# EAGLE design main (EAGLE 7.7.0)
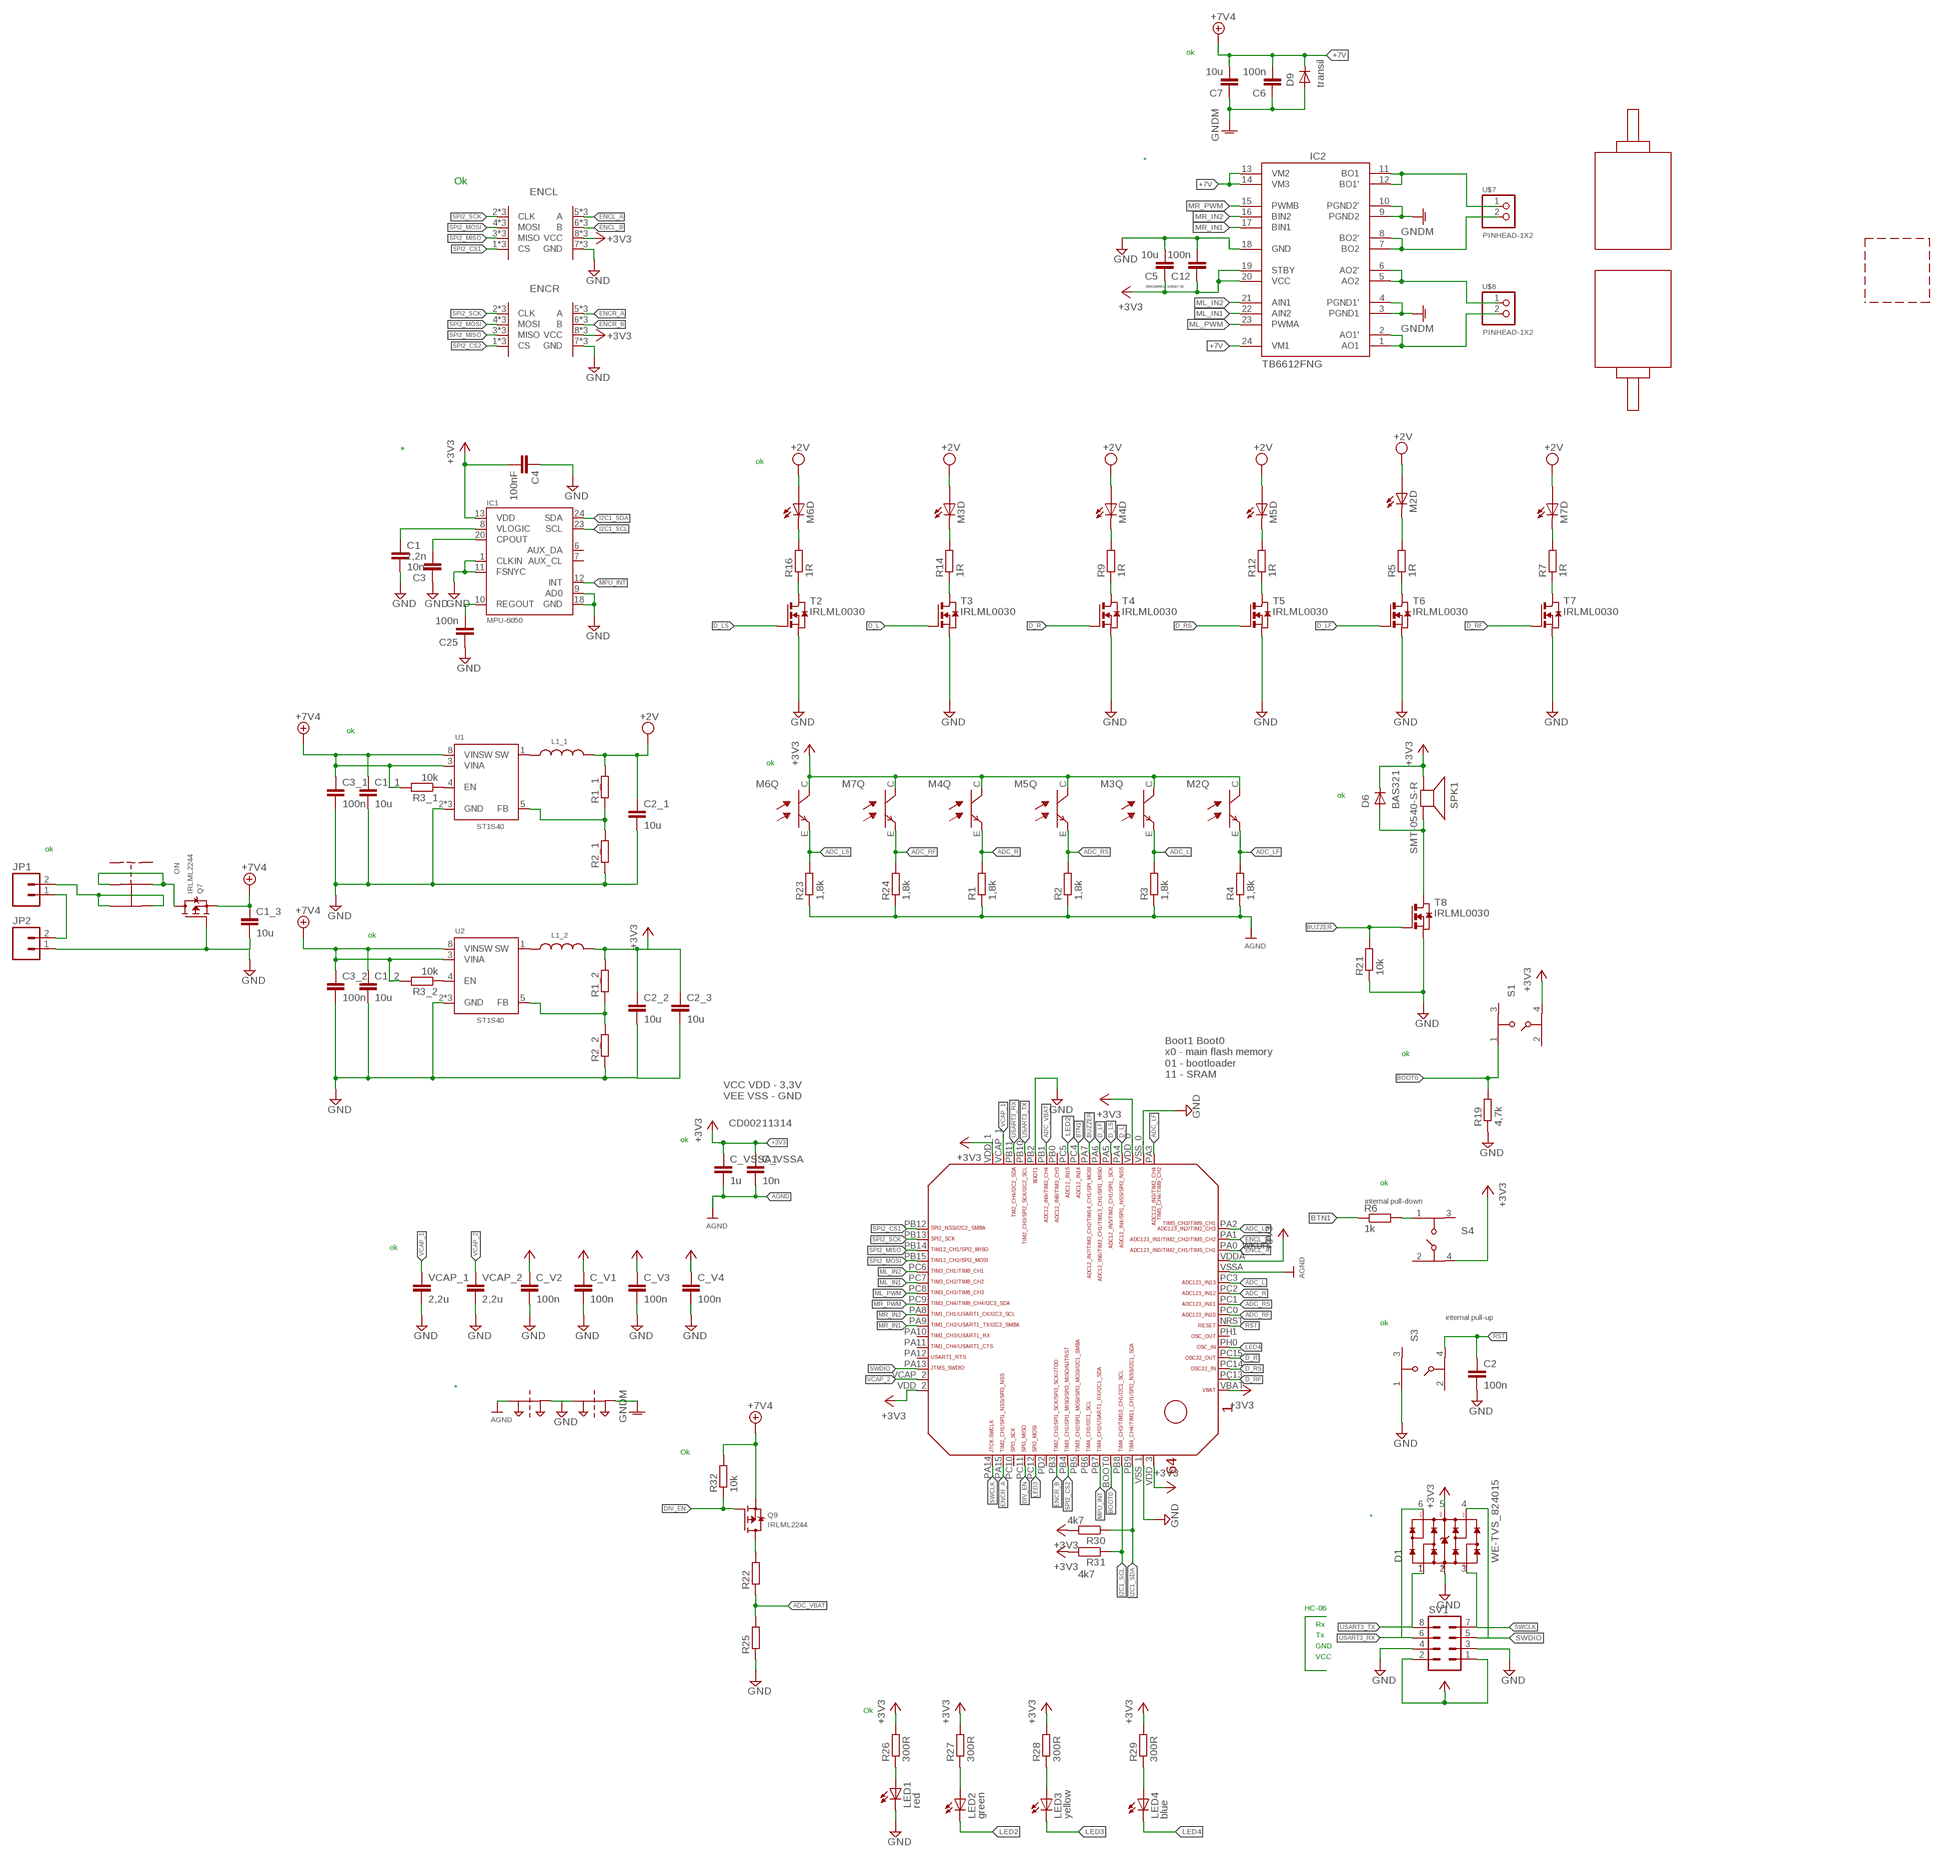
[diagram p0: schematic, sheet 1]

## Parts
C1  10n  C-EUC0603  [C0603]
C1_1  10u  C-EUC0805  [C0805]
C1_2  10u  C-EUC0805  [C0805]
C1_3  10u  C-EUC0805  [C0805]
C2  100n  C-EUC0603  [C0603]
C2_1  10u  C-EUC0805  [C0805]
C2_2  10u  C-EUC0805  [C0805]
C2_3  10u  C-EUC0805  [C0805]
C3  2,2n  C-EUC0603  [C0603]
C3_1  100n  C-EUC0603  [C0603]
C3_2  100n  C-EUC0603  [C0603]
C4  100nF  C-EUC0603  [C0603]
C5  10u  C-EUC0805  [C0805]
C6  100n  C-EUC0603  [C0603]
C7  10u  C-EUC1206  [C1206]
C12  100n  C-EUC0603  [C0603]
C25  100n  C-EUC0603  [C0603]
C_V1  100n  C-EUC0603  [C0603]
C_V2  100n  C-EUC0603  [C0603]
C_V3  100n  C-EUC0603  [C0603]
C_V4  100n  C-EUC0603  [C0603]
C_VSSA  10n  C-EUC0603  [C0603]
C_VSSA1  1u  C-EUC0603  [C0603]
D1  WE-TVS_824015  [WE-TVS_SOT23-6L]
D6  BAS321  [SOD323(F)]
D9  transil  BAS321  [SOD323(F)]
IC1  MPU-6050  [QFN.24.4X4]
IC2  TB6612FNG  [SSOP24]
JP1  M02POLAR  [MOLEX-1X2]
JP2  M02POLAR  [MOLEX-1X2]
L1  LABITYNT  [LABIRYNT]
L1_1  WE-MAIA_3015_78438335068  [WE-MAIA_3015]
L1_2  WE-MAIA_3015_78438335033  [WE-MAIA_3015]
LED1  red  LEDSML1206  [SML1206]
LED2  green  LEDSML1206  [SML1206]
LED3  yellow  LEDSML1206  [SML1206]
LED4  blue  LEDSML1206  [SML1206]
M1  MOTOR_MOUNT_V2  [MOTOR_MOUNT_V2]
M2  LED_MOUNT  [LED_MOUNT]
M3  LED_MOUNT  [LED_MOUNT]
M4  LED_MOUNT  [LED_MOUNT]
M5  LED_MOUNT  [LED_MOUNT]
M6  LED_MOUNT  [LED_MOUNT]
M7  LED_MOUNT  [LED_MOUNT]
ON  PRZELACZNIK_SUWAKOWY  [PRZELACZNIK_SUWAKOWY]
PT1  2PT_GND_TIE  [2PT_GND_TIE]
PT2  2PT_GND_TIE  [2PT_GND_TIE]
Q7  IRLML2244  MOSFET-P  [SOT23-R]
Q9  IRLML2244  MOSFET-P  [SOT23-R]
R1  1,8k  R-EU_R0603  [R0603]
R1_1  R-EU_R0603  [R0603]
R1_2  R-EU_R0603  [R0603]
R2  1,8k  R-EU_R0603  [R0603]
R2_1  R-EU_R0603  [R0603]
R2_2  R-EU_R0603  [R0603]
R3  1,8k  R-EU_R0603  [R0603]
R3_1  10k  R-EU_R0603  [R0603]
R3_2  10k  R-EU_R0603  [R0603]
R4  1,8k  R-EU_R0603  [R0603]
R5  1R  R-EU_R0603  [R0603]
R6  1k  R-EU_R0603  [R0603]
R7  1R  R-EU_R0603  [R0603]
R9  1R  R-EU_R0603  [R0603]
R12  1R  R-EU_R0603  [R0603]
R14  1R  R-EU_R0603  [R0603]
R16  1R  R-EU_R0603  [R0603]
R19  4,7k  R-EU_R0603  [R0603]
R21  10k  R-EU_R0603  [R0603]
R22  R-EU_R0603  [R0603]
R23  1,8k  R-EU_R0603  [R0603]
R24  1,8k  R-EU_R0603  [R0603]
R25  R-EU_R0603  [R0603]
R26  300R  R-EU_R0603  [R0603]
R27  300R  R-EU_R0603  [R0603]
R28  300R  R-EU_R0603  [R0603]
R29  300R  R-EU_R0603  [R0603]
R30  4k7  R-EU_R0603  [R0603]
R31  4k7  R-EU_R0603  [R0603]
R32  10k  R-EU_R0603  [R0603]
S1  434153017835  [434153017835]
S3  434153017835  [434153017835]
S4  434153017835  [434153017835]
SPK1  SMT-0540-S-R  [SMT-0540-S-R]
SV1  MA04-2  [MA04-2]
T2  IRLML0030  NMOSSOT23  [SOT-23]
T3  IRLML0030  NMOSSOT23  [SOT-23]
T4  IRLML0030  NMOSSOT23  [SOT-23]
T5  IRLML0030  NMOSSOT23  [SOT-23]
T6  IRLML0030  NMOSSOT23  [SOT-23]
T7  IRLML0030  NMOSSOT23  [SOT-23]
T8  IRLML0030  NMOSSOT23  [SOT-23]
U1  ST1S40  [SO8]
U2  ST1S40  [SO8]
U3  STM32F4X5  [STM32F4-LQFP64]
U$7  PINHEAD-1X2  [PIHEAD-1X2]
U$8  PINHEAD-1X2  [PIHEAD-1X2]
U$9  ENCODER_MOUNT  [ENCODER_MOUNT]
U$10  ENCODER_MOUNT  [ENCODER_MOUNT]
VCAP_1  2,2u  C-EUC0603  [C0603]
VCAP_2  2,2u  C-EUC0603  [C0603]

## Nets
+3V3: C2_2.1 C2_3.1 C4.2 C5.1 C12.1 C_V1.1 C_V2.1 C_V3.1 C_V4.1 C_VSSA1.1 C_VSSA.1 D1.5(VDD) D6.1(K) IC1.13(VDD) IC2.19(STBY) IC2.20(VCC) L1_2.2 M2.C(Q:C) M3.C(Q:C) M4.C(Q:C) M5.C(Q:C) M6.C(Q:C) M7.C(Q:C) R1_2.2 R26.2 R27.2 R28.2 R29.2 R30.2 R31.2 S1.4 S4.4 SPK1.-(+) SV1.1 SV1.2 U3.VBAT U3.VDD_0 U3.VDD_1 U3.VDD_2 U3.VDD_3 U3.VDDA U$9.8(VCC) U$9.8_1(VCC) U$9.8_2(VCC) U$10.8(VCC) U$10.8_1(VCC) U$10.8_2(VCC)
+7V: C1_1.1 C1_2.1 C1_3.1 C3_1.1 C3_2.1 C6.2 C7.2 D9.1(K) IC2.13(VM2) IC2.14(VM3) IC2.24(VM1) Q7.2(S) Q9.2(S) R3_1.2 R3_2.2 R32.2 U1.3(VINA) U1.8(VINSW) U2.3(VINA) U2.8(VINSW) ; supply symbol labelled +7V4
ADC_L: M3.E(Q:E) R3.2 U3.PC3
ADC_LF: M2.E(Q:E) R4.2 U3.PA3
ADC_LS: M6.E(Q:E) R23.2 U3.PA2
ADC_R: M4.E(Q:E) R1.2 U3.PC2
ADC_RF: M7.E(Q:E) R24.2 U3.PC0
ADC_RS: M5.E(Q:E) R2.2 U3.PC1
ADC_VBAT: R22.1 R25.2 U3.PB1
AGND: C_VSSA1.2 C_VSSA.2 PT1.P$1 R1.1 R2.1 R3.1 R4.1 R23.1 R24.1 U3.VSSA
BOOT0: R19.2 S1.1 U3.BOOT0
BTN1: R6.1 U3.PC4
BUZZER: R21.2 T8.3(G) U3.PA7
D_L: T3.3(G) U3.PA4
D_LF: T6.3(G) U3.PA6
D_LS: T2.3(G) U3.PA5
D_R: T4.3(G) U3.PC15
D_RF: T7.3(G) U3.PC13
D_RS: T5.3(G) U3.PC14
DIV_EN: Q9.1(G) R32.1 U3.PC11
ENCL_A: U3.PA0_WKUP(PA0_AKUP) U$9.5(A) U$9.5_1(A) U$9.5_2(A)
ENCL_B: U3.PA1 U$9.6(B) U$9.6_1(B) U$9.6_2(B)
ENCR_A: U3.PA15 U$10.5(A) U$10.5_1(A) U$10.5_2(A)
ENCR_B: U3.PB3 U$10.6(B) U$10.6_1(B) U$10.6_2(B)
GND: C1.2 C1_1.2 C1_2.2 C1_3.2 C2.2 C2_1.2 C2_2.2 C2_3.2 C3.1 C3_1.2 C3_2.2 C4.1 C5.2 C12.2 C25.1 C_V1.2 C_V2.2 C_V3.2 C_V4.2 D1.2(GND) IC1.1(CLKIN) IC1.9(AD0) IC1.11(FSNYC) IC1.18(GND) IC2.18(GND) JP2.1 LED1.C PT1.P$2 PT2.P$1 Q7.1(G) R2_1.1 R2_2.1 R19.1 R21.1 R25.1 S3.1 SV1.3 SV1.4 T2.2(S) T3.2(S) T4.2(S) T5.2(S) T6.2(S) T7.2(S) T8.2(S) U1.2(GND) U1.6(GND) U1.7(GND) U2.2(GND) U2.6(GND) U2.7(GND) U3.PB2 U3.VSS_0 U3.VSS_1 U$9.7(GND) U$9.7_1(GND) U$9.7_2(GND) U$10.7(GND) U$10.7_1(GND) U$10.7_2(GND) VCAP_1.2 VCAP_2.2
GNDA: C6.1 C7.1 D9.2(A) IC2.3(PGND1) IC2.4(PGND1') IC2.9(PGND2) IC2.10(PGND2') PT2.P$2 ; supply symbol labelled GNDM
I2C1_SCL: IC1.23(SCL) R31.1 U3.PB8
I2C1_SDA: IC1.24(SDA) R30.1 U3.PB9
LED2: LED2.C U3.PC5
LED3: LED3.C U3.PC12
LED4: LED4.C U3.PH0
ML_IN1: IC2.22(AIN2) U3.PC7
ML_IN2: IC2.21(AIN1) U3.PC6
ML_PWM: IC2.23(PWMA) U3.PC8
MPU_INT: IC1.12(INT) U3.PB7
MR_IN1: IC2.17(BIN1) U3.PA9
MR_IN2: IC2.16(BIN2) U3.PA8
MR_PWM: IC2.15(PWMB) U3.PC9
N$1: M7.-(D:C) R7.2
N$2: M2.-(D:C) R5.2
N$4: R5.1 T6.1(D)
N$5: R7.1 T7.1(D)
N$6: M4.-(D:C) R9.2
N$7: R9.1 T4.1(D)
N$8: M5.-(D:C) R12.2
N$9: R12.1 T5.1(D)
N$10: M3.-(D:C) R14.2
N$11: R14.1 T3.1(D)
N$12: M6.-(D:C) R16.2
N$13: R16.1 T2.1(D)
N$14: Q9.3(D) R22.2
N$15: L1_1.1 U1.1(SW)
N$16: L1_2.1 U2.1(SW)
N$17: R3_1.1 U1.4(EN)
N$18: R3_2.1 U2.4(EN)
N$19: JP1.1 JP2.2
N$20: LED1.A R26.1
N$21: LED2.A R27.1
N$22: LED3.A R28.1
N$24: LED4.A R29.1
N$25: R6.2 S4.1
N$29: C25.2 IC1.10(REGOUT)
N$30: D6.2(A) SPK1.+(-) T8.1(D)
N$33: C3.2 IC1.20(CPOUT)
N$34: C1.1 IC1.8(VLOGIC)
N$37: IC2.1(AO1) IC2.2(AO1') U$8.2
N$38: IC2.11(BO1) IC2.12(BO1') U$7.1
N$39: IC2.7(BO2) IC2.8(BO2') U$7.2
N$40: IC2.5(AO2) IC2.6(AO2') U$8.1
N$43: ON.2 ON.5 Q7.3(D)
N$46: JP1.2 ON.3 ON.6
N$52: R1_2.1 R2_2.2 U2.5(FB)
N$53: R1_1.1 R2_1.2 U1.5(FB)
RST: C2.1 S3.4 U3.NRST
SPI2_CS1: U3.PB12 U$9.1(CS) U$9.1_1(CS) U$9.1_2(CS)
SPI2_CS2: U3.PB4 U$10.1(CS) U$10.1_1(CS) U$10.1_2(CS)
SPI2_MISO: U3.PB14 U$9.3(MISO) U$9.3_1(MISO) U$9.3_2(MISO) U$10.3(MISO) U$10.3_1(MISO) U$10.3_2(MISO)
SPI2_MOSI: U3.PB15 U$9.4(MOSI) U$9.4_1(MOSI) U$9.4_2(MOSI) U$10.4(MOSI) U$10.4_1(MOSI) U$10.4_2(MOSI)
SPI2_SCK: U3.PB13 U$9.2(CLK) U$9.2_1(CLK) U$9.2_2(CLK) U$10.2(CLK) U$10.2_1(CLK) U$10.2_2(CLK)
SWCLK: D1.3 SV1.7 U3.PA14
SWDIO: D1.4 SV1.5 U3.PA13
USART3_RX: D1.6 SV1.6 U3.PB11
USART3_TX: D1.1 SV1.8 U3.PB10
VCAP_1: U3.VCAP_1 VCAP_1.1
VCAP_2: U3.VCAP_2 VCAP_2.1
VCC: C2_1.1 L1_1.2 M2.+(D:A) M3.+(D:A) M4.+(D:A) M5.+(D:A) M6.+(D:A) M7.+(D:A) R1_1.2 ; supply symbol labelled +2V
Unconnected: IC1.6(AUX_DA) IC1.7(AUX_CL) ON.1 ON.4 S1.2 S1.3 S3.2 S3.3 S4.2 S4.3 U3.PA10 U3.PA11 U3.PA12 U3.PB0 U3.PB5 U3.PB6 U3.PC10 U3.PD2 U3.PH1

## Notes on the sheet
- ok
- *
- Ok
- ENCL
- GRM188R61C106MA73D
- ENCR
- *
- ok
- ok
- ok
- ok
- ok
- ok
- ok
- Boot1 Boot0
  x0 - main flash memory
  01 - bootloader
  11 - SRAM
- VCC VDD - 3,3V
  VEE VSS - GND
- CD00211314
- ok
- ok
- internal pull-down
- ok
- internal pull-up
- ok
- *
- Ok
- *
- HC-06
- Rx
- Tx
- GND
- VCC
- Ok

## Library data of the parts
C1 C1_1-C1_3 C2 C2_1-C2_3 C3 C3_1 C3_2 C4-C7 C12 C25 C_V1-C_V4 C_VSSA C_VSSA1 VCAP_1 VCAP_2 = rcl:C-EU: CAPACITOR, European symbol
D1 = EAGLE-POWER_MAGNETICS-rev17a:WE-TVS_824015: TVS Diode High Speed Series Characteristics Low clamping voltage Sturdy design Very low capacitance Flow Thru Design for a simple layout Rail to Rail protection Epoxy flame resistant UL94 V-0 RoHS, REACH and free of halogens Applications Very fast data lines USB 2.0 Ethernet PoE VGA Sim Cards Keypads ESD protection in accordance with EN 61000-4-2, – 8 kV contact discharge – 15 kV air discharge <http://katalog.we-online.de/media/images/v2/Family_WE-TVS_HIGHSPEED.jpg> Details see: http://katalog.we-online.de/en/pbs/WE-TVS_High_Speed/824001? Updated by Dan Xu 2014-07-11 2014 (C) Wurth Elektronik
D6 D9 = nxp_60:BAS321: General purpose diode The BAS321 is a general purpose diode fabricated in planar technology and encapsulated in a plastic SOD323 package. AAL Eindhoven MK
IC1 = invensense:MPU-6050
IC2 = _microMouse:TB6612FNG: TB6612FNG MOS dual H-bridge motor driver, 1.2A current 3.2A peak 3 or 5v logic and 3-15v motor
JP1 JP2 = SparkFun_conn:M02: Standard 2-pin 0.1" header. Use with - straight break away headers ( PRT-00116) - right angle break away headers (PRT-00553) - swiss pins (PRT-00743) - machine pins (PRT-00117) - female headers (PRT-00115) Molex polarized connector foot print use with: PRT-08233 with associated crimp pins and housings. 2.54_SCREWTERM for use with PRT-10571. 3.5mm Screw Terminal footprints for PRT-08084 5mm Screw Terminal footprints for use with PRT-08432
L1 = micromouse:LABITYNT
L1_1 = EAGLE-AECQ_PRODUCTS-rev17b:WE-MAIA_3015: WE-MAIA SMD Power Inductor Characteristics Magnetic iron alloy allows high rated currents Compact design Magnetically shielded Hight current capability and handles hight transient current spikes No acoustic noise and no leakage flux noise Operating temperature range:-40°C up to 125°C Applications Power supplies for smartphones, tablet PCs and other mobile devices DC/DC-converter for high current power supplies DC/DC-converter for Field Programmable Gate Array (FPGA) POL-converters Portable power like PDA, digital camera Mainboards/graphic cards Battery powered devices Wireless communication devices <http://katalog.we-online.de/media/images/eisos/IndMAIA_pf2.jpg> Details see: http://katalog.we-online.de/en/pbs/WE-MAIA/ Created: 2015-02-04 2015 (C) Wurth Elektronik; WE-NUMBER: 78438335068/6,8uH
L1_2 = EAGLE-AECQ_PRODUCTS-rev17b:WE-MAIA_3015: WE-MAIA SMD Power Inductor Characteristics Magnetic iron alloy allows high rated currents Compact design Magnetically shielded Hight current capability and handles hight transient current spikes No acoustic noise and no leakage flux noise Operating temperature range:-40°C up to 125°C Applications Power supplies for smartphones, tablet PCs and other mobile devices DC/DC-converter for high current power supplies DC/DC-converter for Field Programmable Gate Array (FPGA) POL-converters Portable power like PDA, digital camera Mainboards/graphic cards Battery powered devices Wireless communication devices <http://katalog.we-online.de/media/images/eisos/IndMAIA_pf2.jpg> Details see: http://katalog.we-online.de/en/pbs/WE-MAIA/ Created: 2015-02-04 2015 (C) Wurth Elektronik; WE-NUMBER: 78438335033/3,3uH
LED1-LED4 = led:LED: LED OSRAM: - CHIPLED LG R971, LG N971, LY N971, LG Q971, LY Q971, LO R971, LY R971 LH N974, LH R974 LS Q976, LO Q976, LY Q976 LO Q996 - Hyper CHIPLED LW Q18S LB Q993, LB Q99A, LB R99A - SideLED LS A670, LO A670, LY A670, LG A670, LP A670 LB A673, LV A673, LT A673, LW A673 LH A674 LY A675 LS A676, LA A676, LO A676, LY A676, LW A676 LS A679, LY A679, LG A679 - Hyper Micro SIDELED® LS Y876, LA Y876, LO Y876, LY Y876 LT Y87S - SmartLED LW L88C, LW L88S LB L89C, LB L89S, LG L890 LS L89K, LO L89K, LY L89K LS L896, LA L896, LO L896, LY L896 - TOPLED LS T670, LO T670, LY T670, LG T670, LP T670 LSG T670, LSP T670, LSY T670, LOP T670, LYG T670 LG T671, LOG T671, LSG T671 LB T673, LV T673, LT T673, LW T673 LH T674 LS T676, LA T676, LO T676, LY T676, LB T676, LH T676, LSB T676, LW T676 LB T67C, LV T67C, LT T67C, LS T67K, LO T67K, LY T67K, LW E67C LS E67B, LA E67B, LO E67B, LY E67B, LB E67C, LV E67C, LT E67C LW T67C LS T679, LY T679, LG T679 LS T770, LO T770, LY T770, LG T770, LP T770 LB T773, LV T773, LT T773, LW T773 LH T774 LS E675, LA E675, LY E675, LS T675 LS T776, LA T776, LO T776, LY T776, LB T776 LHGB T686 LT T68C, LB T68C - Hyper Mini TOPLED® LB M676 - Mini TOPLED Santana® LG M470 LS M47K, LO M47K, LY M47K Source: http://www.osram.convergy.de LUXEON: - LUMILED® LXK2-PW12-R00, LXK2-PW12-S00, LXK2-PW14-U00, LXK2-PW14-V00 LXK2-PM12-R00, LXK2-PM12-S00, LXK2-PM14-U00 LXK2-PE12-Q00, LXK2-PE12-R00, LXK2-PE12-S00, LXK2-PE14-T00, LXK2-PE14-U00 LXK2-PB12-K00, LXK2-PB12-L00, LXK2-PB12-M00, LXK2-PB14-N00, LXK2-PB14-P00, LXK2-PB14-Q00 LXK2-PR12-L00, LXK2-PR12-M00, LXK2-PR14-Q00, LXK2-PR14-R00 LXK2-PD12-Q00, LXK2-PD12-R00, LXK2-PD12-S00 LXK2-PH12-R00, LXK2-PH12-S00 LXK2-PL12-P00, LXK2-PL12-Q00, LXK2-PL12-R00 Source: www.luxeon.com KINGBRIGHT: KA-3528ASYC Source: www.kingbright.com
M1 = micromouse:MOTOR_MOUNT_V2
M2-M7 = micromouse:LED_MOUNT
ON = micromouse:PRZELACZNIK_SUWAKOWY
PT1 PT2 = SparkFun-Passives:2PT_GND_TIE: Package for connecting two ground nets in one place.
Q7 Q9 = microbuilder:MOSFET-P: P-Channel Mosfet LEGEND VDS: Voltage Drain-Source ID: Drain Current RDS(ON): Drain-Source On-State Resistance VGS(TH): Gate-Source Threshold Voltage CISS: Drain-Source Input Capacitance SOT-23 Name VDS ID RDS(ON) VGS(TH) CISS Order Number IRLML5103 30V 760mA 600 mOhm -- 75pF @ 25V Digikey: IRLML5103PBFCT-ND IRLML6401 12V 4.3A 50 mOhm 950mV @ 250µA 830pF @ 10V Digikey: IRLML6401PBFTR-ND NTR0202PL 20V 400mA 800 mOhm 2.3V @ 250uA 70pF @ 5V Digikey: NTR0202PLT1GOSTR-ND NTR4101PT1G 20V 1.8A 85 mOhm 1.2V @ 250uA 675pF @ 10V Digikey: NTR4101PT1GOSCT-ND DMP2004K 20V 600mA 900 mOhm 1V @ 250uA 175pF @ 16V Digikey: DMP2004KDICT-ND PMV65XP 20V 3.9A 76 mOhm 950mV @ 1mA 725pF @ 20V Digikey: 568-2358-2-ND TO-252 Name VDS ID RDS(ON) VGS(TH) CISS Order Number AOD417 30V 25A 34 mOhm 3V @ 250µA 920pF @ 15V Digikey: 785-1106-2-ND
R1 R1_1 R1_2 R2 R2_1 R2_2 R3 R3_1 R3_2 R4-R7 R9 R12 R14 R16 R19 R21 R23 R24 R30 R31 = rcl:R-EU_: RESISTOR, European symbol
R22 R25-R29 R32 = resistor:R-EU_: RESISTOR, European symbol
S1 S3 S4 = EAGLE-TACT_SWITCHES-rev17c:434153017835: WS-TASV Tact Switch J-Bend SMD version Specification Rating : 50mA, 12VDC Contact Resistance Initial: 100mΩ max. After life test:1mΩ max. Insulation Resistance: min.100MΩ at 500VDC Dielectric Strength : 250VAC for 1 minute Stroke:0.15±0.1mm Bounce :10ms max. Material Cover : : Stainless steel Stem :LCP UL 94 V-0. FramePA46 UL HB, color Black >Contact : Stainless Steel with Silver Tape:Polyimide tape Terminal : Copper Alloy with Silver <http://katalog.we-online.de/media/images/v2/WS-TASU_434331013822_a_4C.jpg> Details see: http://katalog.we-online.de/em/datasheet/434153017835.pdf 2015 (C) Würth Elektronik
SPK1 = adafruit:SMT-0540-S-R: SMT-0549-S-R Small surface-mount magnetic buzzer
SV1 = con-lstb:MA04-2: PIN HEADER; OC_FARNELL: unknown; OC_NEWARK: unknown
T2-T8 = zetex:NMOSSOT23: MOS FET; OC_FARNELL: unknown; OC_NEWARK: unknown
U1 U2 = micromouse:ST1S40
U3 = _microMouse:STM32F4X5
U$7 U$8 = BaseApp:PINHEAD-1X2
U$9 U$10 = micromouse:ENCODER_MOUNT

## Board
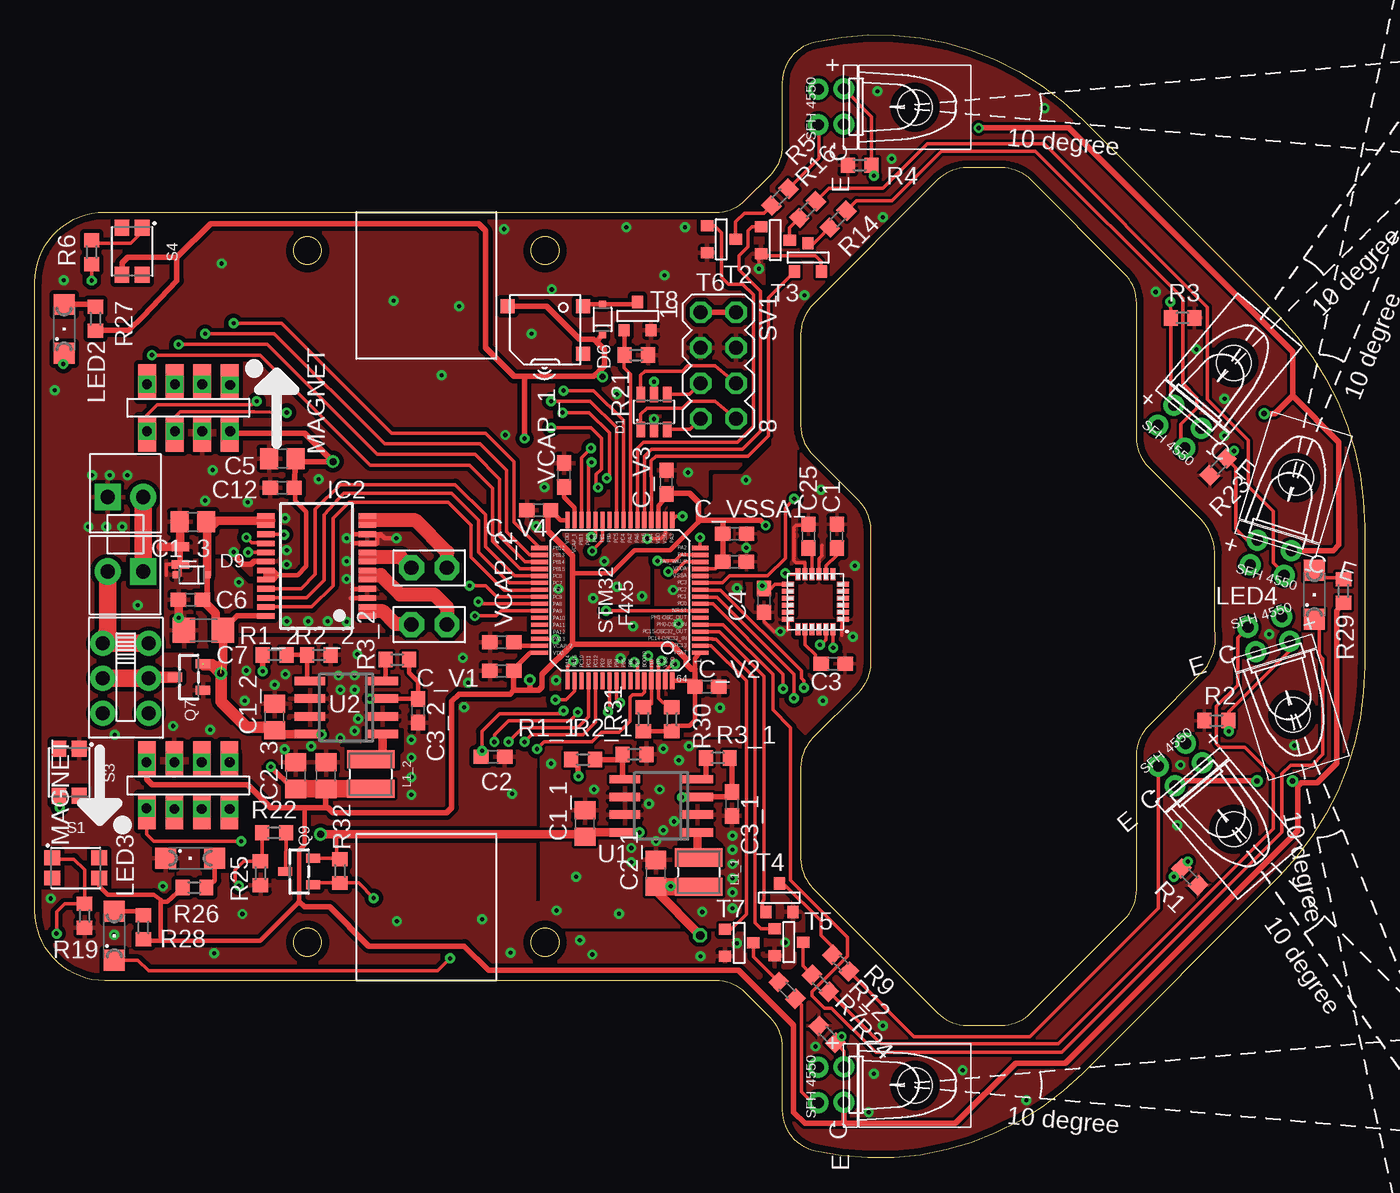
[diagram p1: board, top side]
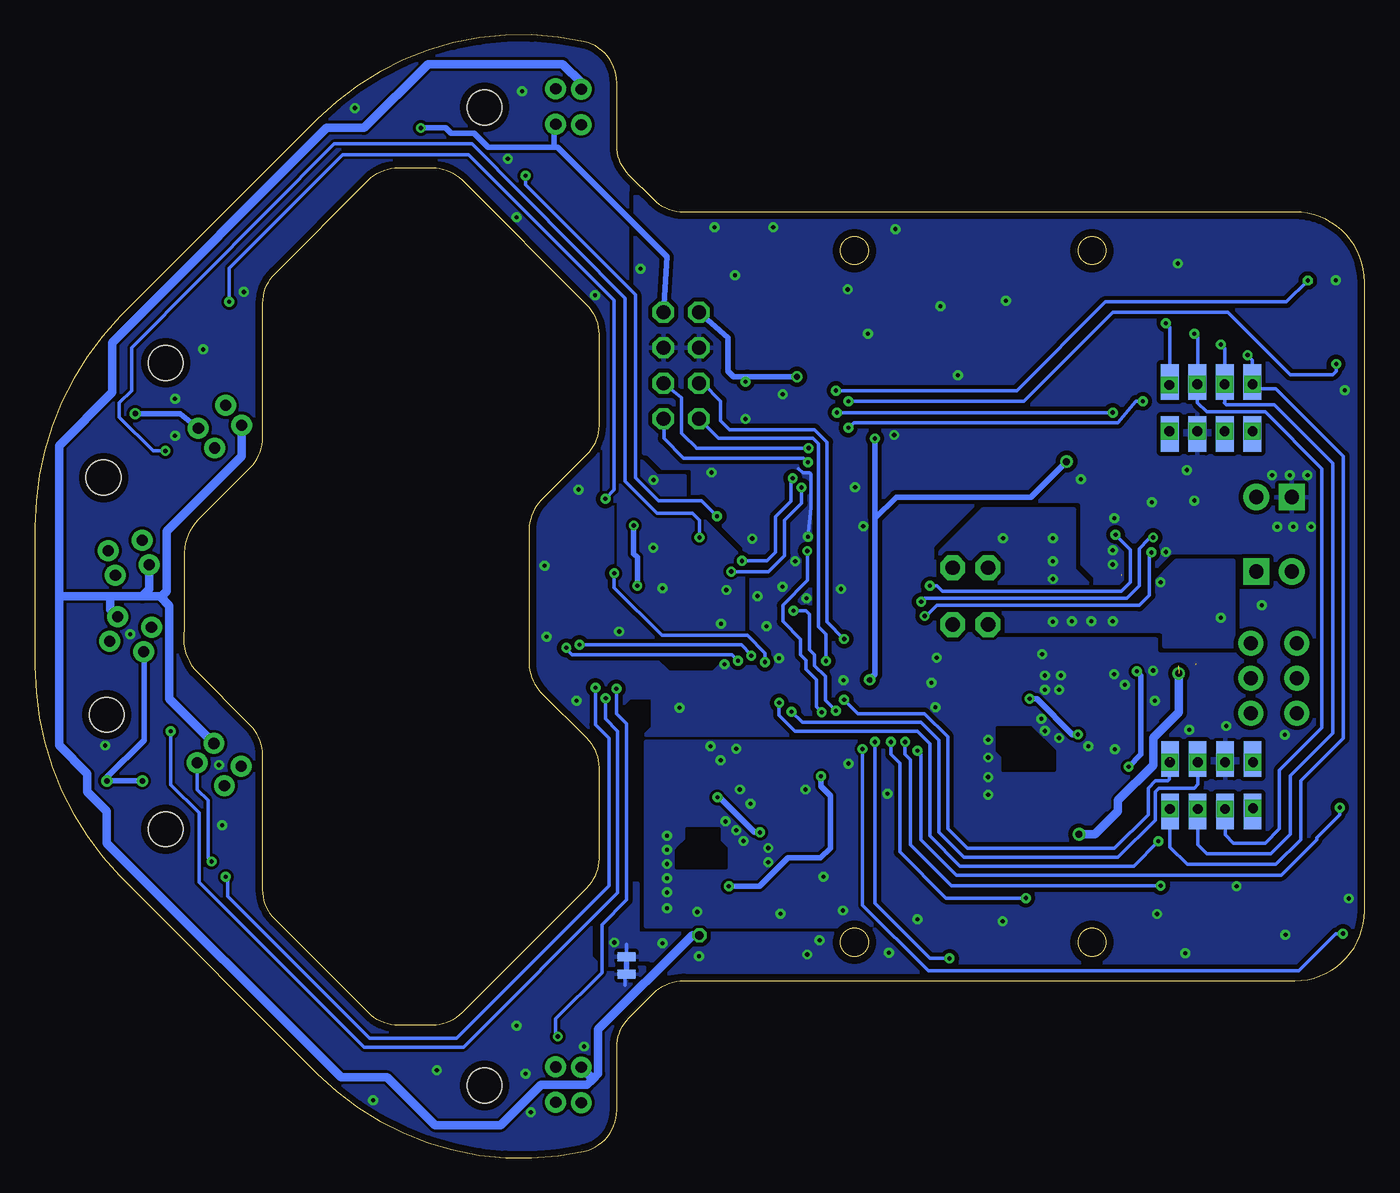
[diagram p2: board, bottom side, seen from below]

Size 95.2 x 80.37 mm. Coordinates in mm from the lower left corner, seen from the top.
Outline: 0,62.69 arc-90 5,67.69 48.76,67.69 arc45 50.88,68.57 52.66,70.34 arc45 53.54,72.46 53.54,76.96 arc-77 55.88,79.89 arc-58 74.99,74.33 89.14,60.19 arc-44 95.19,45.19 95.19,35.18 arc-44 89.14,20.18 74.99,6.04 arc-58 55.88,0.48 arc-77 53.54,3.41 53.54,7.91 arc45 52.66,10.03 50.88,11.81 arc45 48.76,12.68 5,12.68 arc-90 0,17.68 0,62.69
Outline: 71.3,69.99 arc45 69.18,70.87 66.75,70.87 arc45 64.63,69.99 55.7,61.07 arc45 54.83,58.94 54.83,52.43 arc45 55.7,50.31 58.95,47.07 arc-45 59.83,44.94 59.83,35.43 arc-45 58.95,33.31 55.7,30.06 arc45 54.83,27.94 54.83,21.43 arc45 55.7,19.31 64.63,10.38 arc45 66.75,9.5 69.18,9.5 arc45 71.3,10.38 78,17.08 arc45 78.88,19.2 78.88,28.82 arc-45 79.76,30.95 83.74,34.93 arc45 84.49,37.81 84.49,43.32 arc45 83.23,45.95 79.76,49.43 arc-45 78.88,51.55 78.88,61.17 arc45 78,63.29 71.3,69.99
Copper layers (1*16): Top 0.035mm / dielectric 1.5mm / Bottom 0.035mm
Design rules "default *": minimum track width 10mil, minimum drill 10mil, track to track 8mil, track to pad 8mil, pad to pad 7mil, via to via 7mil, smd to smd 4mil, copper to edge 20mil, drill to drill 8mil, minimum pad ring 10mil, minimum via ring 8mil, stop-mask expansion 4mil, vias tented up to drill 20mil, thermal gap 10mil
tRestrict: 7 lines
bRestrict: area 45.7,20.8 to 49.3,23.5; 7 lines

### Footprints (pad centres in the part's own frame; a part is rotated, then mirrored left to right if it is on the bottom)
C0603 = smd 1.1 x 1: 1 -0.85,0; 2 0.85,0
C0805 = smd 1.3 x 1.5: 1 -0.95,0; 2 0.95,0
C1206 = smd 1.6 x 1.8: 1 -1.4,0; 2 1.4,0
WE-TVS_SOT23-6L = smd 0.6 x 1.1: 1 -0.95,-1.25; 2 0,-1.25; 3 0.95,-1.25; 4 0.95,1.25; 5 0,1.25; 6 -0.95,1.25
SOD323(F) = smd 0.5 x 0.5: 1 1.1,0; 2 -1.1,0
QFN.24.4X4 = smd 0.85 x 0.38: 1 -1.975,1.25; 2 -1.975,0.75; 3 -1.975,0.25; 4 -1.975,-0.25; 5 -1.975,-0.75; 6 -1.975,-1.25; 13 1.975,-1.25; 14 1.975,-0.75; 15 1.975,-0.25; 16 1.975,0.25; 17 1.975,0.75; 18 1.975,1.25 | smd 0.38 x 0.85: 7 -1.25,-1.975; 8 -0.75,-1.975; 9 -0.25,-1.975; 10 0.25,-1.975; 11 0.75,-1.975; 12 1.25,-1.975; 19 1.25,1.975; 20 0.75,1.975; 21 0.25,1.975; 22 -0.25,1.975; 23 -0.75,1.975; 24 -1.25,1.975
SSOP24 = smd 0.4 x 1.25: 1 -3.575,-3.625; 2 -2.925,-3.625; 3 -2.275,-3.625; 4 -1.625,-3.625; 5 -0.975,-3.625; 6 -0.325,-3.625; 7 0.325,-3.625; 8 0.975,-3.625; 9 1.625,-3.625; 10 2.275,-3.625; 11 2.925,-3.625; 12 3.575,-3.625; 13 3.575,3.625; 14 2.925,3.625; 15 2.275,3.625; 16 1.625,3.625; 17 0.975,3.625; 18 0.325,3.625; 19 -0.325,3.625; 20 -0.975,3.625; 21 -1.625,3.625; 22 -2.275,3.625; 23 -2.925,3.625; 24 -3.575,3.625
MOLEX-1X2 = drill 1.016 pad 1.88 square: 1 0,0 | drill 1.016 pad 1.88: 2 2.54,0
WE-MAIA_3015 = smd 1.3 x 3.4: 1 -1.05,0; 2 1.05,0
SML1206 = smd 1.5 x 1.5: A 1.75,0; C -1.75,0
LED_MOUNT = drill 0.8 pad 1.5: + -6.922,1.307; - -6.922,-1.233; C -5.091,-1.213; E -5.091,1.327 | hole 2.5: 0,0
PRZELACZNIK_SUWAKOWY = drill 1 pad 1.778: 1 -1.23,0; 2 1.27,0; 3 3.77,0; 4 -1.23,-3.3; 5 1.27,-3.3; 6 3.77,-3.3
2PT_GND_TIE = smd 1.27 x 0.635: P$1 0,0.635; P$2 0,-0.635
SOT23-R = smd 0.635 x 1.016: 1 -0.95,-1; 2 0.95,-1; 3 0,1
R0603 = smd 1 x 1.1: 1 -0.85,0; 2 0.85,0
434153017835 = smd 1.15 x 1.05: 1 -1.675,0.725; 2 -1.675,-0.725; 3 1.675,0.725; 4 1.675,-0.725
SMT-0540-S-R = smd 1 x 1: + 1.7,-2.7; - 1.7,2.7; M -1.7,-2.7
MA04-2 = drill 1.016 octagon: 1 -3.81,-1.27; 2 -3.81,1.27; 3 -1.27,-1.27; 4 -1.27,1.27; 5 1.27,-1.27; 6 1.27,1.27; 7 3.81,-1.27; 8 3.81,1.27
SOT-23 = smd 0.787 x 0.889: 1 0.025,-1.016; 2 -0.94,1.016; 3 0.991,1.016
SO8 = smd 0.6 x 2.2: 1 -1.905,-2.6; 2 -0.635,-2.6; 3 0.635,-2.6; 4 1.905,-2.6; 5 1.905,2.6; 6 0.635,2.6; 7 -0.635,2.6; 8 -1.905,2.6
STM32F4-LQFP64 = smd 1.2 x 0.3: BOOT0 -5.75,-1.75; PA3 5.75,-3.75; PA4 5.75,-2.25; PA5 5.75,-1.75; PA6 5.75,-1.25; PA7 5.75,-0.75; PA14 -5.75,3.75; PA15 -5.75,3.25; PB0 5.75,0.75; PB1 5.75,1.25; PB2 5.75,1.75; PB3 -5.75,0.75; PB4 -5.75,0.25; PB5 -5.75,-0.25; PB6 -5.75,-0.75; PB7 -5.75,-1.25; PB8 -5.75,-2.25; PB9 -5.75,-2.75; PB10 5.75,2.25; PB11 5.75,2.75; PC4 5.75,-0.25; PC5 5.75,0.25; PC10 -5.75,2.75; PC11 -5.75,2.25; PC12 -5.75,1.75; PD2 -5.75,1.25; VCAP_1 5.75,3.25; VDD_0 5.75,-2.75; VDD_1 5.75,3.75; VDD_3 -5.75,-3.75; VSS_0 5.75,-3.25; VSS_1 -5.75,-3.25 | smd 0.3 x 1.2: NRST -0.75,-5.75; PA0_WKUP 2.75,-5.75; PA1 3.25,-5.75; PA2 3.75,-5.75; PA8 -0.25,5.75; PA9 -0.75,5.75; PA10 -1.25,5.75; PA11 -1.75,5.75; PA12 -2.25,5.75; PA13 -2.75,5.75; PB12 3.75,5.75; PB13 3.25,5.75; PB14 2.75,5.75; PB15 2.25,5.75; PC0 -0.25,-5.75; PC1 0.25,-5.75; PC2 0.75,-5.75; PC3 1.25,-5.75; PC6 1.75,5.75; PC7 1.25,5.75; PC8 0.75,5.75; PC9 0.25,5.75; PC13 -3.25,-5.75; PC14 -2.75,-5.75; PC15 -2.25,-5.75; PH0 -1.75,-5.75; PH1 -1.25,-5.75; VBAT -3.75,-5.75; VCAP_2 -3.25,5.75; VDD_2 -3.75,5.75; VDDA 2.25,-5.75; VSSA 1.75,-5.75
PIHEAD-1X2 = drill 1.016 pad 1.778 octagon: 1 -1.27,0; 2 1.27,0
ENCODER_MOUNT = smd 1.27 x 2.54: 1 2.97,1.87; 2 1,1.87; 3 -0.97,1.87; 4 -2.94,1.87; 5 -2.94,-1.87; 6 -0.97,-1.87; 7 1,-1.87; 8 2.97,-1.87 | smd 1.27 x 2.54 bottom: 1_1 2.97,1.873; 2_1 1,1.873; 3_1 -0.97,1.873; 4_1 -2.94,1.873; 5_1 -2.938,-1.869; 6_1 -0.968,-1.869; 7_1 1.002,-1.869; 8_1 2.972,-1.869 | drill 0.7 square: 1_2 3,1.65; 2_2 1,1.7; 3_2 -0.95,1.7; 4_2 -2.95,1.7; 5_2 -2.95,-1.65; 6_2 -0.95,-1.65; 7_2 1,-1.65; 8_2 3,-1.65

### Placement (x,y rotation side)
C1  57.4,44.5 90 top
C1_1  39.37,23.93 90 top
C1_2  17.16,31.55 90 top
C1_3  11.3,45.52 180 top
C2  32.79,28.71 0 top
C2_1  44.45,20.37 90 top
C2_2  20.84,27.36 90 top
C2_3  18.67,27.36 90 top
C3  57.15,35.36 180 top
C3_1  49.91,25.33 270 top
C3_2  27.43,32 270 top
C4  52.2,39.91 90 top
C5  17.72,50.04 180 top
C6  11.14,39.94 0 top
C7  12.07,37.77 0 top
C12  17.71,47.96 180 top
C25  55.37,44.5 270 top
C_V1  33.42,34.86 180 top
C_V2  48.11,33.71 0 top
C_V3  45.21,48.37 90 top
C_V4  36.07,46.36 180 top
C_VSSA  50.09,42.66 0 top
C_VSSA1  50.1,44.67 0 top
D1  44.32,53.39 0 top
D6  40.64,60 270 top
D9  11.23,41.74 0 top
IC1  55.88,39.81 180 top
IC2  20.16,42.36 90 top
JP1  7.75,41.98 180 top
JP2  5.21,47.3 0 top
L1  28,40.19 270 top
L1_1  47.52,20.45 270 top
L1_2  24.05,27.47 270 top
LED1  11.12,21.45 0 top
LED2  2.09,59.33 90 top
LED3  5.68,15.89 90 top
LED4  91.6,40.31 90 top
M1  28.02,40.19 0 top
M2  63,75.19 0 top
M3  85.84,56.9 50 top
M4  85.83,23.52 310 top
M5  90.05,31.72 287 top
M6  90.28,48.69 73 top
M7  63,5.19 0 top
ON  4.86,33.06 90 top
PT1  52.83,13.77 180 bottom
PT2  10.41,43.11 0 top
Q7  11.03,34.41 90 top
Q9  18.92,20.5 90 top
R1  82.68,20.12 135 top
R1_1  10k  [R0603]  39.24,28.5 180 top
R1_2  10k  [R0603]  17.16,36 180 top
R2  84.58,31.3 0 top
R2_1  31k  [R0603]  42.93,28.88 180 top
R2_2  15k  [R0603]  20.34,36 180 top
R3  82.17,60.13 180 top
R3_1  48.9,28.63 0 top
R3_2  25.95,35.67 0 top
R4  59.05,71.05 0 top
R5  53.34,68.76 45 top
R6  4.06,64.82 90 top
R7  53.85,11.99 315 top
R9  57.68,13.95 315 top
R12  56.24,12.5 315 top
R14  57.51,67.19 45 top
R16  55.32,67.87 45 top
R19  3.56,17.33 90 top
R21  43.05,57.46 180 top
R22  10k  [R0603]  17.12,23.27 0 top
R23  84.71,49.46 45 top
R24  56.72,8.84 315 top
R25  15k  [R0603]  16.15,20.37 90 top
R26  11.43,19.35 180 top
R27  4.34,60.06 270 top
R28  7.76,16.5 270 top
R29  93.68,40.57 270 top
R30  45.59,31.4 270 top
R31  43.56,31.4 270 top
R32  21.84,20.53 90 top
S1  2.92,20.76 0 top
S3  2.44,27.6 270 top
S4  6.95,64.88 270 top
SPK1  36.53,59.27 90 top
SV1  48.93,56.71 270 top
T2  53.01,65.66 90 top
T3  55.37,64.44 180 top
T4  53.31,18.62 180 top
T5  53.98,15.42 90 top
T6  49.15,65.71 90 top
T7  50.42,15.37 90 top
T8  43.18,60.25 180 top
U1  44.83,25.2 90 top
U2  22.29,32.24 90 top
U3  41.88,39.9 90 top
U$7  28.23,42.23 180 top
U$8  28.23,38.17 180 top
U$9  10.97,53.66 0 top
U$10  10.99,26.68 180 top
VCAP_1  37.9,48.87 90 top
VCAP_2  33.43,36.91 180 top

### Tracks (layer width: path | path; a pad name or v marks a point on that pad's centre or on a via)
+3V3  (via drill 0.3, 0.4, 0.5)  (3 unrouted)
  Top 0.254: C12.1 18.62,47.9 | IC1.13 arc-90 IC1.13 52.98,41.05 52.54,40.6 C4.2 52.07,40.86 v52.07,40.95 | U3.VDDA 48.73,42.15 C_VSSA.1 | C2_2.1 21.93,26.41 21.97,26.45 | D1.5 v44.32,55.55
  Top 0.305: IC2.19 IC2.20 arc-90 16.86,41.71 17.4,41.71 | 17.4,41.71 18.8,41.71 19.43,42.35 19.43,46.23 18.62,47.04 18.62,47.9 | 17.4,41.71 17.04,42.07 16.76,42.07 | U3.VBAT 47.24,35.77 47.24,34.98 47.24,34.73 | 47.24,34.1 47.19,34.15 U3.VDD_3 | R31.2 R30.2 45.61,30.92 46.86,30.92 47.26,31.31 C_V2.1 | R28.2 7.77,15.55 9.02,15.55 | 9.02,15.55 16.13,15.55 18.92,18.34 18.92,22.03 19.3,22.41 19.3,25.05 | 9.02,18.34 9.02,18.47 8.51,18.85 5.21,18.85 4.6,19.46 S1.4 | 9.02,18.34 9.02,15.55 | R26.2 9.47,18.34 9.02,18.34 | C_V4.1 37.62,45.65 U3.VDD_1 | U3.VDD_0 44.63,46.69 44.98,47.04 44.98,47.29 C_V3.1 | U3.VDD_2 35.44,36.15 34.27,34.99 C_V1.1 | 47.5,45.52 45.47,43.49 42.93,43.49 41.27,41.84 38.48,41.84 | 17.37,41.69 17.04,41.35 16.71,41.35
  Top 0.406: R1_2.2 v16.31,34.83 | C2_2.1 20.83,26.39 20.83,25.2 20.98,25.05 | 20.98,25.05 21.34,24.69 29.46,24.69 29.84,25.07 29.84,32.69 30.35,33.2 34.01,33.2 34.27,33.47 | 8,28.53 U$10.8 7.99,28.52 U$10.8_2 7.99,27.1 8.38,26.7 15.24,26.7 16.89,25.05 19.3,25.05 20.98,25.05 | 38.48,36.76 36.32,34.6 36.32,33.71 36.07,33.46 35.43,33.46 | U$9.8_1 14.02,51.87 | 14.02,51.87 19.3,51.87 v21.34,49.84 18.77,49.84 C5.1 C12.1 | v35.43,34.22 35.43,33.46 | C_V1.1 34.27,33.47 | 34.27,33.47 35.31,33.46 35.43,33.46 | C_V2.1 47.24,34.1 47.24,34.73 | 38.48,36.76 45.59,36.76 46.61,35.74 46.61,35.36 46.99,34.98 47.24,34.98 | C_V3.1 45.24,47.55 46.86,47.55 47.5,46.92 47.5,45.65 | 47.5,45.52 47.5,45.65 | C_VSSA.1 49.25,42.67 C_VSSA1.1 49.25,45.55 49.15,45.65 | 47.5,45.65 49.15,45.65 | 49.15,45.65 51.94,45.65 v52.32,45.27 | SPK1.- 36.62,60.97 38.99,58.6 40.01,58.6 40.2,58.41 | 40.2,58.41 40.77,57.84 40.77,56.7 40.39,56.32 | D6.1 40.2,58.45 40.2,58.41 | v35.05,51.49 35.05,55.93 | 35.05,55.93 34.29,55.93 32.26,57.97 32.26,66.35 31.75,66.86 12.57,66.86 10.16,64.44 | 35.05,55.93 40.01,55.93 40.39,56.32 | SV1.2 SV1.1 | v40.64,55.91 40.39,55.91 40.39,56.32 | S4.4 6.25,63.23 6.25,64.06 6.63,64.44 10.16,64.44 | 10.16,64.44 10.16,62.79 7.75,60.25 6.73,59.23 4.34,59.23 R27.2 | 57.91,2.47 55.12,2.47 54.3,3.28 54.3,9.5 50.37,13.44 32.46,13.44 30.73,15.17 23.88,15.17 21.08,17.96 19.3,17.96 18.92,18.34 | 57.91,2.47 65.91,2.47 70.23,6.79 73.79,6.79 90.42,23.42 90.42,26.6 | 90.42,26.6 v90.04,26.98 | v87.5,26.98 81.96,26.98 M4.C | 90.42,26.6 90.68,26.85 91.82,26.85 93.22,28.25 93.22,39.16 R29.2 | v67.56,73.71 74.04,73.71 90.04,57.71 90.04,54.54
  Top 0.406: 90.04,54.54 93.34,51.24 93.34,43.87 92.94,43.47 M6.C | 90.04,54.54 88.77,53.27 v88.01,53.27 | 38.48,36.76 38.48,41.84 38.48,43.11 36.73,44.86 36.73,46.17 arc-90 C_V4.1 | M7.C 57.91,2.47 | 14.02,51.87 13.97,51.92 U$9.8_2 | v16.89,27.99 18.48,26.41 C2_3.1
  Top 1.27: L1_2.2 arc-90 24.03,26.41 C2_2.1 C2_3.1
  Bottom 0.254: v44.32,55.55 44.2,55.91
  Bottom 0.406: v16.31,34.83 16,34.52 16,28.88 v16.89,27.99 | v21.34,49.84 23.88,47.3 33.53,47.3 35.05,45.77 | 35.05,45.77 35.05,34.6 v35.43,34.22 | v52.32,45.27 52.32,43.23 52.07,42.98 v52.07,40.95 | 35.05,45.77 v35.05,51.49 | SV1.1 45.59,58.71 45.59,56.32 45.19,55.91 44.2,55.91 v40.64,55.91 | v87.5,26.98 v90.04,26.98 90.04,27.23 87.38,29.9 87.38,36.2 M5.C | SV1.2 49.95,64.48 57.78,72.32 58.04,72.32 | 58.04,72.32 62.74,72.32 63.75,73.33 65.41,73.33 65.79,73.71 v67.56,73.71 | M2.C 58.04,73.84 58.04,72.32 | v88.01,53.27 84.81,53.27 M3.C
+7V  (via drill 0.3, 0.5)  (2 unrouted)
  Top 0.254: 21.59,23.17 21.59,21.58 R32.2 21.84,21.45 Q9.2 | U2.8 20.5,30.33 v20.52,30.31 | v23.98,32.87 U2.3 | v43.28,23.3 U1.8 | v46.33,25.81 47.41,25.81 U1.3 | IC2.14 16.78,45.29 arc90 17.02,45.52 arc180 17.02,45.65 17.02,45.94 IC2.13
  Top 0.305: U2.3 27.43,32.87 C3_2.1 27.43,34.09 26.8,34.72 R3_2.2
  Top 0.406: R3_1.2 49.91,28.63 C3_1.1 49.91,25.84 U1.3 | IC2.24 14.49,38.79 C7.2 | C6.2 12.33,40.28 D9.1 | 16.13,45.6 16.13,45.65 17.02,45.65
  Top 0.61: 13.35,35.22 13.47,35.34 C7.2 12.95,38.29 12.95,38.97 C6.2 | U2.8 17.43,30.33 arc-90 C1_2.1 | 39.3,22.91 arc90 C1_1.1 | C1_1.1 39.69,23.3 U1.8 | v20.45,23.17 21.59,23.17 39.37,23.17 C1_1.1 | 12.25,45.33 C1_3.1 12.33,45.32 12.33,44.89 | D9.1 12.33,44.89 | 16.13,45.6 13.04,45.6 12.33,44.89
  Top 0.813: 17.12,30.64 C1_2.1 16.9,30.6 16.66,30.84 15.16,30.84 13.35,32.66 13.35,35.22 | 12.08,35.31 12.68,35.31 v13.31,34.67
  Bottom 0.254: 20.62,30.28 20.55,30.28 v20.52,30.31
  Bottom 0.406: 20.62,30.28 20.9,30.28 23.47,32.85 23.95,32.85 v23.98,32.87 | v43.28,23.3 43.66,23.3 46.18,25.81 v46.33,25.81
  Bottom 0.61: v13.31,34.67 13.31,31.88 15.11,30.08 15.11,28.12 17.65,25.58 17.65,24.82 19.3,23.17 v20.45,23.17
ADC_L  (via drill 0.3)
  Top 0.254: U3.PC3 49.23,41.15 49.73,41.66 52.45,41.66 53.72,42.93 53.72,46.54 v54.36,47.17 | v81.28,61.27 81.32,60.34 R3.2 81.32,54.41 M3.E
  Bottom 0.254: v81.28,61.27 81.28,63.68 73.15,71.81 64.14,71.81 53.72,61.4 53.72,47.81 v54.36,47.17
ADC_LF  (via drill 0.3)
  Top 0.254: U3.PA3 45.9,45.93 v46.35,45.93 | v60.07,70.29 60.07,71.05 R4.2 59.91,74.52 M2.E
  Bottom 0.254: v46.35,45.93 47.47,47.04 50.55,47.04 52.2,48.7 52.2,61.78 60.07,69.65 v60.07,70.29
ADC_LS  (via drill 0.3)
  Top 0.254: 47.65,43.64 U3.PA2 v47.62,44.4 | M6.E 86.78,44.21 85.98,45.01 85.98,49.39 R23.2 v85.85,50.6
  Bottom 0.254: v47.62,44.4 47.62,45.65 48.13,46.16 50.67,46.16 52.96,48.44 52.96,61.52 63.88,72.57 73.79,72.57 88.27,57.97 88.27,54.92 89.15,54.03 89.15,53.01 86.74,50.6 v85.85,50.6
ADC_R  (via drill 0.3)
  Top 0.254: U3.PC2 47.64,40.64 49.07,40.64 54.86,34.85 54.86,34.34 55.07,34.14 v55.07,33.66 | v81.53,20.12 82.08,20.66 R1.2 82.55,21.2 v82.55,21.21
  Bottom 0.254: v55.07,33.66 55.07,31.02 54.1,30.05 54.1,19.49 65.02,8.56 71.25,8.56 81.41,18.72 81.41,19.99 v81.53,20.12 | v82.55,21.21 82.8,21.47 82.8,25.58 83.57,26.35 M4.E
ADC_RF  (via drill 0.3)
  Top 0.254: U3.PC0 48.54,39.65 53.57,34.62 v53.57,33.58 | v57.76,8.69 v57.76,8.68 R24.2 57.91,7.65 M7.E
  Bottom 0.254: v53.57,33.58 53.57,31.8 52.83,31.07 52.83,18.47 54.61,16.69 54.61,13.26 57.91,9.96 57.91,9.45 57.91,8.84 v57.76,8.69
ADC_RS  (via drill 0.3)
  Top 0.254: U3.PC1 47.65,40.14 48.82,40.14 54.33,34.62 v54.33,32.9 | v85.47,30.53 85.47,31.3 | 85.47,31.3 R2.2 | 85.47,31.3 85.47,31.93 89.83,36.29 M5.E
  Bottom 0.254: v54.33,32.9 54.36,32.87 54.36,31.42 53.47,30.53 53.47,18.98 64.52,7.93 71.63,7.93 83.44,19.74 83.44,24.69 85.47,26.72 v85.47,30.53
ADC_VBAT  (via drill 0.3)
  Top 0.254: U3.PB1 40.64,44.2 v39.9,43.44 | v32.89,29.77 32.89,30.28 33.91,31.3 38.33,31.3 38.86,31.83 v38.86,31.91 | v14.61,19.49 14.35,19.74 14.35,20.63 14.95,21.22 R25.2 16.07,21.24 16.27,21.24 R22.1
  Bottom 0.254: v14.61,19.49 29.59,19.49 32.51,22.41 32.51,28.5 32.89,28.88 v32.89,29.77 | v38.86,31.91 39.24,32.29 39.24,34.22 40.01,34.98 40.01,35.61 40.39,36 40.39,37.14 41.66,38.41 41.66,39.55 39.88,41.33 v39.9,43.44
AGND  (via drill 0.3)
  Bottom 0.254: 52.96,13.14 52.96,12.37
  other vias: 60.71,9.45 66.42,6.28 70.99,4.12 90.17,29.52 88.37,37.47 80.24,61.98 50.9,48.52 50.27,40.77 50.93,43.67 45.69,40.64 46.08,38.23 55.88,7.98 60.07,6.02 59.69,3.28 81.79,23.8 82.02,28.12 83.16,57.86 85.17,54.33 60.71,67.31 55.09,61.75 60.33,76.33 72.29,75.14 85.17,51.69 61.34,71.5
  pour Top (rank 4): 51.44,-1.6 69.09,-1.6 97.41,26.72 97.41,53.9 68.58,82.73 55.63,82.73 52.7,80.06 52.83,50.98 50.67,48.82 48.64,48.82 48.64,47.04 44.45,42.85 44.45,37.52 46.86,35.11 51.31,35.11 51.44,34.98 51.44,20.12 54.61,20.12 55.37,19.36 55.37,14.41 54.23,13.26 52.83,13.26 51.44,11.87
  pour Bottom (rank 4): 51.44,-1.6 69.09,-1.6 97.41,26.72 97.41,53.9 68.58,82.73 55.63,82.73 52.7,80.06 52.83,50.98 50.67,48.82 48.64,48.82 48.64,47.04 44.45,42.85 44.45,37.52 46.86,35.11 51.31,35.11 51.44,34.98 51.44,20.12 54.61,20.12 55.37,19.36 55.37,14.41 54.23,13.26 52.83,13.26 52.45,13.64 51.56,13.64 51.44,11.87
BOOT0  (via drill 0.3)
  Top 0.254: U3.BOOT0 43.63,33.32 43.46,33.15 42.8,33.15 42.62,32.97 42.62,31.25 41.83,30.46 40.56,30.46 39.88,29.77 36.45,29.77 v35.94,29.26 | S1.1 1.34,21.39 2.79,21.39 3.56,20.63 R19.2 2.12,18.18 1.55,17.61 v1.55,16.06
  Bottom 0.254: v35.94,29.26 35.94,18.09 31.24,13.39 4.72,13.39 2.06,16.06 v1.55,16.06
BTN1  (via drill 0.3)
  Top 0.254: U3.PC4 42.14,52.78 40.01,54.92 v37.85,54.92 | v4.06,62.79 R6.1
  Bottom 0.254: v37.85,54.92 24.89,54.92 18.54,61.27 5.59,61.27 v4.06,62.79
BUZZER
  Top 0.254: R21.2 42.16,57.42 42.16,56.57 42.63,56.1 U3.PA7
  Top 0.305: R21.2 42.2,59.22 arc90 T8.3
D_L
  Top 0.254: U3.PA4 44.15,45.69 44.15,48.77 44.12,48.8 44.12,49.89 44.45,50.22 51.05,50.22 52.53,51.69 52.53,61.57 T3.3
D_LF
  Top 0.254: U3.PA6 43.13,50.81 43.56,51.24 50.29,51.24 51.44,52.38 51.44,61.78 50.67,62.54 49.66,62.54 49.15,63.05 49.15,66.22 48.67,66.7 T6.3
D_LS
  Top 0.254: 43.61,45.69 U3.PA5 43.63,50.21 44.15,50.73 50.67,50.73 51.94,52 51.94,62.03 50.42,63.55 50.42,64.57 51.05,65.21 51.05,66.37 51.33,66.65 T2.3
D_R
  Top 0.254: U3.PC15 49.02,37.65 52.2,34.47 52.2,18.49 arc90 T4.3
D_RF
  Top 0.254: U3.PC13 48.41,36.66 50.93,34.14 50.93,17.45 49.84,16.36 T7.3
D_RS
  Top 0.254: U3.PC14 48.51,37.15 48.51,37.14 48.77,37.14 51.56,34.34 51.56,16.82 51.97,16.41 T5.3 52.73,16.41
DIV_EN  (via drill 0.3)
  Top 0.254: U3.PC11 39.62,31.58 38.86,30.79 34.92,30.79 v33.91,29.77 | v24.26,18.6 23.18,19.68 R32.1 20.05,19.68 Q9.1
  Bottom 0.254: v33.91,29.77 33.91,28.88 33.27,28.25 33.27,21.9 29.97,18.6 v24.26,18.6
ENCL_A  (via drill 0.3)  (1 unrouted)
  Top 0.254: U3.PA0_WKUP 46.56,42.65 45.87,41.96 v45.34,41.96 | v15.88,54.16 15.49,53.9 8.76,53.9 8.02,53.16 U$9.5_2 | v36.96,52.25 39.8,52.25 40.56,51.49 40.56,49.31 40.18,48.92 40.18,48.16 v40.31,47.98
  Bottom 0.254: v15.88,54.16 16.38,54.16 17.65,52.63 36.58,52.63 v36.96,52.25 | v40.31,47.98 40.31,46.87 41.53,45.65 41.53,43.11 42.67,41.96 v45.34,41.96 | U$9.5_2 8.03,52 U$9.5_1
ENCL_B  (via drill 0.3)  (1 unrouted)
  Top 0.254: U3.PA1 46.25,43.16 45.82,42.73 v44.58,42.73 | U$9.6_1 | v18.03,53.34 15.7,53.39 10.41,53.39 10.02,53 U$9.6_2 | v37.77,53.34 39.67,53.34 41.12,51.9 41.12,48.8 v40.95,48.64
  Bottom 0.254: v18.03,53.34 v37.77,53.34 | v44.58,42.73 42.8,42.73 42.16,43.36 42.16,45.9 41.07,46.99 41.07,48.52 v40.95,48.64 | U$9.6_1 10.02,51.81 U$9.6_2
ENCR_A  (via drill 0.3)  (1 unrouted)
  Top 0.254: U3.PA15 38.63,33.4 38.02,32.8 v37.26,32.8
  Bottom 0.254: v37.26,32.8 36.27,31.8 31.5,31.8 29.84,30.15 29.84,23.55 28.45,22.15 17.91,22.15 15.49,24.57 15.49,26.47 14.99,26.98 14.1,26.98 13.97,27.11 13.97,28.5 U$10.5_1 13.92,28.34 U$10.5_2
ENCR_B  (via drill 0.3)  (1 unrouted)
  Top 0.254: U3.PB3 41.13,32.04 v41.02,31.93
  Bottom 0.254: 11.94,28.53 U$10.6_1 11.95,28.34 U$10.6_2 11.94,26.73 12.19,26.47 14.73,26.47 14.99,26.22 14.99,24.18 17.65,21.52 28.7,21.52 30.48,23.3 30.48,29.9 31.75,31.17 40.26,31.17 v41.02,31.93
GND  (via drill 0.3)
  Top 0.254: 55.12,41.79 IC1.11 55.13,42.59 55.12,42.6 54.48,42.6 54.36,42.73 54.36,45.14 54.48,45.27 55.24,45.27 55.37,45.39 | IC1.1 57.78,38.49 57.78,37.39 | C4.1 52.2,38.41 52.96,37.65 | IC1.18 53.91,37.83 53.85,37.77 | T3.2 56.26,63.48 56.26,64.19 55.88,64.57 52.15,64.57 T2.2 51.82,64.72 v51.84,63.63 | U3.VSS_1 45.14,34.85 45.62,35.34 v45.82,35.34 | U3.PB2 40.13,44.45 v39.85,44.45 | U3.VSS_0 45.14,44.66 44.81,44.33 v43.84,44.33 | IC1.9 56.13,42.87 56.36,43.11 56.36,43.84 | v46.84,29.47 46.84,29.62 | D1.2 v44.32,52.89
  Top 0.406: IC2.18 15.71,42.69 15.49,42.47 14.86,42.47 14.48,42.85 14.48,43.11 v14.22,43.36
  Top 0.61: 10.41,44.63 PT2.P$1 9.02,43.74
  Bottom 0.254: 40.51,49.33 40.21,49.03 39.73,49.03 39.62,48.92 39.62,47.55 arc8 v39.85,44.45 | PT1.P$2 52.83,15.29 | v44.32,52.89 44.32,53.14
  other vias: 23.09,36.05 21.87,33.51 47.78,17.61 41.81,17.48 44.73,26.37 46.1,28.45 47.65,14.43 49.94,23.07 49.94,22.05 49.94,21.03 49.94,20.02 49.94,19 49.94,17.86 44.98,29.29 45.75,24.08 44.98,23.45 44.48,22.69 42.7,22.18 42.7,21.16 40.03,26.37 43.97,25.35 26.95,29.92 26.95,28.65 26.95,27.26 26.95,25.99 22.89,30.56 23.14,31.42 21.87,30.05 17.93,34.62 17.17,33.86 19.79,29.47 12.55,30.64 17.88,29.24 12.83,14.66 25.91,16.95 20.32,48.57 35.56,58.98 41.66,54.66 45.09,63.17 43.46,40.21 42.82,38.05 39.95,40.06 9.17,19.43 5.66,15.98 14.86,17.45 53.72,15.42 46.53,66.6 49.05,32.21 53.37,37.67 41.94,35.77 46.76,49.05 36.47,48.01 41.68,40.87 37.49,40.72 35.89,45.22 30.63,35.79 31.01,34.01 34.16,26.06 30.73,32.26 37.31,34.19 58.57,37.29 50.27,15.37 29.11,56.01 25.68,61.34 33.68,51.74 40.77,42.7 34.06,14.68 39.01,15.57 32,17.07 38.73,20.12 37.34,17.71 5.71,30.28 9.91,30.92 7.37,39.55 39.9,14.56 56.41,32.72 58.7,42.37 56.29,47.83 12.73,49.23 5.36,48.85 1.42,54.94 2.06,62.82 1.14,18.57 4.09,48.85 6.63,48.85 3.84,45.16 6.25,45.16 5.11,45.16 15.14,34.88 42.34,66.6 33.58,66.48 37.01,62.16 18.03,43.49 18.03,42.47 17.91,45.77 15.24,46.92 12.19,47.04 30.38,60.96 13.36,64.01 22.89,33.51 22.89,34.52 21.74,34.52 15.01,32.72 36.96,28.22
  pour Top (rank 3): 14.99,37.14 27.94,37.14 27.94,35.87 29.21,35.87 29.21,24.95 16.26,24.95 16.26,29.01 14.99,29.01 14.99,29.26 14.1,30.15 14.1,30.92 14.22,31.04 14.86,31.04
  pour Bottom (rank 3): 27.94,37.14 27.94,35.87 29.21,35.87
  pour Top (rank 3): 36.32,29.77 51.44,29.77 51.44,16.56 35.31,16.56 35.31,18.22 36.32,18.22
  pour Top (isolate 0.305, rank 6): 51.44,30.28 35.81,30.28 35.69,16.06 52.07,16.06 52.07,19.61 54.99,19.61 54.99,14.53 54.1,13.64 52.58,13.64 50.42,11.48 2.67,11.48 -0.51,14.66 -0.51,65.84 2.41,68.76 52.07,68.76 52.32,51.24 50.42,49.33 48.13,49.33 48.13,47.3 43.94,43.11 43.94,37.39 46.61,34.73 50.42,34.73 50.93,34.22 50.93,30.79
  pour Top (isolate 0.305, rank 3): 56.26,29.26 60.2,33.84 60.2,46.28 55.75,50.73 54.86,50.73 54.86,46.79 53.85,46.79 53.85,42.6 52.96,41.71 50.93,41.71 50.93,35.87 49.66,34.6 49.66,33.46 50.16,32.95 52.58,32.95
  pour Bottom (isolate 0.305, rank 6): 51.44,30.28 35.81,30.28 35.69,16.06 52.07,16.06 52.07,19.61 54.99,19.61 54.99,14.53 54.1,13.64 52.58,13.64 50.42,11.48 2.67,11.48 -0.51,14.66 -0.51,65.84 2.41,68.76 52.32,68.76 52.32,51.24 50.39,49.33 48.13,49.33 48.13,47.3 43.94,43.11 43.94,37.39 46.61,34.73 50.42,34.73 50.93,34.22 50.93,30.79
  pour Bottom (rank 3): 14.99,37.14 27.94,37.14 27.94,35.87 29.21,35.87 29.21,24.95 16.26,24.95 16.26,29.01 14.99,29.01 14.99,29.26 14.1,30.15 14.1,30.92 14.22,31.04 14.86,31.04
  pour Bottom (rank 3): 36.32,29.77 51.44,29.77 51.44,16.56 36.32,16.56 35.31,16.56 35.31,18.22 36.32,18.22
  pour Bottom (isolate 0.305, rank 3): 56.26,29.26 60.2,33.84 60.2,46.28 55.75,50.73 54.86,50.73 54.86,46.79 53.85,46.79 53.85,42.6 52.96,41.71 50.93,41.71 50.93,35.87 49.66,34.6 49.66,33.46 50.16,32.95 52.58,32.95
GNDA  (via drill 0.3)
  Top 0.254: 10.41,41.71 PT2.P$2 9.4,42.47 9.4,41.71
  Top 0.305: IC2.4 23.74,40.69 22.73,40.69 | IC2.3 23.76,40.06 22.61,40.06 | 22.73,44.63 IC2.10 24.77,44.63 | IC2.9 23.78,44 22.73,44 | 24.77,44.63 24.51,44.38 24.51,43.95 | 24.77,44.63 25.04,44.35 v25.88,44.35
  Top 0.61: C7.1 10.29,37.77 C6.1
  other vias: 14.61,41.2 20.95,38.41 10.29,38.66 22.33,38.38 22.33,44.35 22.33,42.7 22.33,41.43 19.56,38.41 18.03,38.41
  pour Top (isolate 0.305, rank 4): 9.4,36.63 14.35,36.63 14.35,37.65 30.35,37.65 30.35,43.36 27.3,46.41 20.83,46.41 20.83,42.09 19.68,40.95 15.24,40.95 13.46,42.73 9.4,42.73
  pour Bottom (isolate 0.305, rank 4): 9.4,36.63 14.35,36.63 14.35,37.65 30.35,37.65 30.35,43.36 27.3,46.41 20.83,46.41 20.83,42.09 19.68,40.95 15.24,40.95 13.46,42.73 9.4,42.73
I2C1_SCL  (via drill 0.3)
  Top 0.254: v43.92,35.94 43.92,35.72 44.15,35.54 44.15,34.17 U3.PB8 44.15,34.14 44.15,32.5 R31.1 | IC1.23 56.63,37.08 56.29,36.73 v56.21,36.73
  Bottom 0.254: v56.21,36.73 44.6,36.73 43.92,36.02 v43.92,35.94
I2C1_SDA  (via drill 0.3)
  Top 0.254: U3.PB9 | U3.PB9 44.63,35.19 v44.86,35.59 | v57.15,36.5 57.13,36.52 IC1.24 | R30.1 45.53,32.57 44.96,32.57 44.63,32.89 U3.PB9
  Bottom 0.254: 57.15,36.38 v57.15,36.5 57.15,36.43 56.74,36.02 45.29,36.02 v44.86,35.59
LED2  (via drill 0.3)
  Top 0.254: U3.PC5 41.63,52.28 39.75,54.16 v36.96,54.16 | v2.03,56.82 2.09,56.88 LED2.C
  Bottom 0.254: v36.96,54.16 24.38,54.16 18.03,60.51 9.78,60.51 5.33,56.06 2.29,56.06 2.03,56.32 v2.03,56.82
LED3  (via drill 0.3)
  Top 0.254: U3.PC12 40.13,31.17 39.24,30.28 35.56,30.28 v35.05,29.77 | v29.72,14.28 28.83,13.39 8.13,13.39 7.38,14.14 LED3.C
  Top 0.305: 5.26,14.08 5.19,14.14 LED3.C
  Bottom 0.254: v35.05,29.77 35.05,18.22 31.11,14.28 v29.72,14.28
LED4
  Top 0.254: U3.PH0 49.28,38.15 52.83,34.6 52.83,32.06 54.1,30.79 54.1,19.87 58.17,15.8 58.17,14.43 55.63,11.89 55.63,11.61 56.52,10.72 57.02,10.72 60.2,7.55 73.53,7.55 89.28,23.3 89.28,27.49 89.92,28.12 91.44,28.12 92.2,28.88 92.2,35.74 91.95,36 91.95,38.21 arc90 LED4.C
ML_IN1
  Top 0.254: IC2.22 19.46,40.09 20.7,41.33 20.7,46.03 22.1,47.55 29.84,47.55 31.75,45.65 31.75,43.36 33.96,41.15 U3.PC7
ML_IN2
  Top 0.254: IC2.21 19.05,40.75 20.07,41.76 20.07,46.41 21.84,48.19 30.1,48.19 32.26,46.03 32.26,43.74 34.34,41.66 U3.PC6
ML_PWM
  Top 0.254: U3.PC8 36.12,40.64 33.58,40.64 31.24,42.98 31.24,45.27 29.59,46.92 22.48,46.92 21.34,45.77 21.34,40.95 19.82,39.44 IC2.23
MPU_INT  (via drill 0.3)
  Top 0.254: v42.93,35.49 43.13,35.28 U3.PB7 | v53.72,41.84 53.78,41.78 IC1.12
  Bottom 0.254: v42.93,35.49 42.93,36.12 44.2,37.39 50.29,37.39 53.72,40.82 v53.72,41.84
MR_IN1  (via drill 0.3)
  Top 0.254: IC2.17 | v31.5,38.79 33.02,38.79 33.38,39.15 U3.PA9 | v15.27,43.34 15.39,43.34 IC2.17
  Bottom 0.254: v31.5,38.79 31.37,38.79 30.61,39.55 16.13,39.55 15.39,40.29 15.39,43.34 v15.27,43.34
MR_IN2  (via drill 0.3)
  Top 0.254: IC2.16 16.57,44.02 15.52,44.02 v15.14,44.4 | v31.75,39.81 31.9,39.65 U3.PA8
  Bottom 0.254: v31.75,39.81 31.5,40.06 17.02,40.06 16.13,40.95 16.13,43.62 15.47,44.28 v15.14,44.4
MR_PWM  (via drill 0.3)
  Top 0.254: IC2.15 17.8,44.63 v17.83,44.61 | v31.11,40.95 32.26,40.95 33.05,40.15 U3.PC9
  Bottom 0.254: v31.11,40.95 30.61,40.95 30.23,40.57 17.4,40.57 16.76,41.2 16.76,43.54 v17.83,44.61
N$1
  Top 0.254: M7.- 55.66,3.95 54.86,4.75 54.86,10.98 R7.2
N$2
  Top 0.254: R5.2 56.13,71.56 56.13,73.95 M2.-
N$4
  Top 0.254: 52.61,68.16 R5.1 52.2,67.62 50.8,67.62 50.16,66.98 T6.1
N$5
  Top 0.254: T7.1 51.44,14.41 R7.1
N$6
  Top 0.254: M4.- 80.44,17.88 71.25,8.69 62.94,8.69 R9.2
N$7
  Top 0.254: 57.21,14.47 R9.1 57.08,15.11 56.26,15.93 56.26,16.97 53.59,19.64 T4.1 53.59,19.33 53.7,19.33
N$8
  Top 0.254: R12.2 60.55,8.18 73.28,8.18 88.65,23.55 88.65,27.36 86.61,29.39 84.84,29.39 84.58,29.65 84.58,32.31 86.11,33.84 86.11,37.23 M5.-
N$9
  Top 0.254: T5.1 54.99,13.75 R12.1
N$10
  Top 0.254: R14.2 58.83,68.51 61.34,68.51 64.9,72.06 71.63,72.06 82.17,61.52 82.17,55.43 83.19,54.41 83.19,53.65 82.04,52.51 82.04,51.1 M3.-
N$11
  Top 0.254: T3.1 55.73,65.43 56.88,66.59 R14.1
N$12
  Top 0.254: M6.- 89.43,41.81 88.65,42.6 88.65,46.28 86.87,48.06 86.87,51.36 83.95,54.28 83.95,60.89 72.26,72.57 63.88,72.57 60.71,69.4 56.84,69.4 R16.2
N$13
  Top 0.254: T2.1 54.03,66.58 R16.1
N$14
  Top 0.254: Q9.3 17.97,20.67 R22.2
N$15
  Top 0.61: L1_1.1 47.43,21.5 U1.1
N$16
  Top 0.61: U2.1 24.89,28.52 L1_2.1
N$17
  Top 0.406: R3_1.1 48.05,27.11 U1.4
N$18
  Top 0.305: U2.4 25.1,34.35 R3_2.1
N$19
  Top 1.27: JP2.2 7.75,46.92 JP1.1
N$20
  Top 0.305: R26.1 12.87,19.84 LED1.A
N$21
  Top 0.406: R27.1 4.26,61.08 LED2.A
N$22
  Top 0.305: R28.1 7.7,17.64 LED3.A
N$24
  Top 0.254: LED4.A 92.14,41.52 93.58,41.52 R29.1
N$25
  Top 0.254: R6.2 4.41,65.46 6.86,65.46 7.68,66.28 S4.1
N$29
  Top 0.254: C25.2 55.63,43.27 IC1.10
N$30
  Top 0.305: SPK1.+ 39.36,61.1 D6.2 42.98,61.1 arc90 T8.1
N$33
  Top 0.254: IC1.20 55.13,36.75 55.88,36 55.88,35.78 C3.2
N$34
  Top 0.254: IC1.8 56.64,41.79 56.64,42.37 57.4,43.13 C1.1
N$37
  Top 0.406: IC2.1 23.7,38.79 23.37,39.12 23.47,39.12 IC2.2 23.89,39.44 24.21,39.12
  Top 1.016: U$8.2 26.92,38.21 25.83,38.21 24.92,39.12 24.21,39.12
N$38
  Top 0.406: 24.23,45.62 23.37,45.62 23.37,45.6 23.79,45.6 | 23.79,45.6 IC2.12 | 23.79,45.6 IC2.11
  Top 1.016: U$7.1 29.52,42.25 29.52,43.36 27.25,45.62 24.23,45.62
N$39
  Top 0.254: 23.47,42.9 23.79,42.9 IC2.8
  Top 0.305: 24.18,43.01 23.86,42.69 IC2.7
  Top 0.61: 24.18,43.01 23.47,43.01 23.47,42.9
  Top 1.016: U$7.2 26.18,43.01 24.18,43.01
N$40
  Top 0.406: 23.39,41.71 arc90 23.42,41.74 23.48,41.74 arc90 IC2.6 23.79,42 arc-90 23.75,41.96 23.98,41.96 arc-90 24.23,41.71 | 23.39,41.71 23.37,41.71 | 23.62,41.58 23.62,41.55 arc90 IC2.5 arc90 23.46,41.71 23.39,41.71
  Top 1.016: 24.23,41.71 24.77,41.71 26.14,40.34 28.57,40.34 29.5,39.42 U$8.1
N$43
  Top 0.813: ON.5 8.58,34.41 Q7.3
  Top 1.27: ON.2 ON.5
N$46
  Top 1.27: JP1.2 5.21,37.68 ON.3 ON.6
N$52
  Top 0.305: R1_2.1 R2_2.2 19.49,34.35 U2.5
N$53
  Top 0.406: U1.5 42.08,27.26 R2_1.2 41.7,28.5 R1_1.1
RST  (via drill 0.3)
  Top 0.254: U3.NRST 47.62,39.17 v40.89,39.17 | v37.85,32.01 37.64,31.8 33.27,31.8 32,30.53 v32,29.14 31.94,29.07 C2.1 | v1.78,25.07 1.78,25.86 S3.4
  Bottom 0.254: v40.89,39.17 40.01,39.17 39.75,38.92 39.75,36.38 39.37,36 39.37,35.23 38.61,34.47 38.61,32.77 v37.85,32.01 | v1.78,25.07 1.78,24.57 3.43,22.91 3.43,22.79 5.97,20.25 29.21,20.25 31.75,22.79 31.75,28.88 v32,29.14
SPI2_CS1  (via drill 0.3)
  Top 0.254: U3.PB12 34.29,45.5 34.29,49.84 32.26,51.87 25.53,51.87 17.65,59.74 v14.22,59.74
  Bottom 0.254: U$9.1_1 13.94,59.46 v14.22,59.74
SPI2_CS2  (via drill 0.3)
  Top 0.254: U3.PB4 41.63,32.84 v41.91,32.57 | v14.76,22.66 8.51,22.66 8,23.17 8,24.79 U$10.1_1
  Bottom 0.254: v14.76,22.66 16.51,20.88 28.96,20.88 31.11,23.04 31.11,29.65 32,30.53 40.77,30.53 41.91,31.68 v41.91,32.57
SPI2_MISO  (via drill 0.3)  (2 unrouted)
  Top 0.254: U3.PB14 35.1,42.65 33.27,44.48 33.27,48.57 31.5,50.35 24.51,50.35 16.64,58.22 v10.29,58.22
  Bottom 0.254: v10.29,58.22 10,57.93 U$9.3_1 10.02,55.52 U$9.3_2 10.02,54.03 10.03,54.03 9.91,53.9 6.48,53.9 2.29,49.71 2.29,30.41 5.33,27.36 5.33,23.17 6.73,21.77 11.3,21.77 11.96,22.42 U$10.3_1 11.94,24.82 U$10.3_2
SPI2_MOSI  (via drill 0.3)  (2 unrouted)
  Top 0.254: U3.PB15 36.12,42.14 36.09,42.17 34.72,42.17 32.77,44.12 32.77,47.93 31.11,49.58 24,49.58 16.13,57.46 v8.38,57.46 | 8.41,56.55 8.03,55.28 8.02,55.29 U$9.4_2
  Bottom 0.254: v8.38,57.46 8.03,57.11 U$9.4_1 | U$9.4_1 | U$9.4_1 U$9.4_2 7.86,55.36 7.54,55.05 6.35,55.05 1.52,50.22 1.52,30.03 4.57,26.98 4.57,22.79 6.35,21.01 12.7,21.01 13.93,22.24 U$10.4_1 U$10.4_2
SPI2_SCK  (via drill 0.3)  (2 unrouted)
  Top 0.254: U3.PB13 35.41,43.16 35.23,43.34 33.78,44.81 33.78,49.2 31.88,51.11 25.02,51.11 17.14,58.98 v12.19,58.98
  Bottom 0.254: v12.19,58.98 11.94,58.73 11.94,55.54 U$9.2_1 | U$9.2_1 U$9.2_2 11.97,54.06 11.3,53.39 7.11,53.39 3.05,49.33 3.05,30.79 6.1,27.74 6.1,23.55 7.11,22.53 9.4,22.53 9.99,23.12 U$10.2_1 U$10.2_2 | U$9.2_1
SWCLK  (via drill 0.3)
  Top 0.254: U3.PA14 38.13,35.14 v38.56,35.56 | D1.3 46.91,52.14 SV1.7
  Bottom 0.254: v38.56,35.56 38.56,37.47 39.12,38.03 39.12,51.11 39.5,51.49 46.25,51.49 SV1.7 47.53,52.79 46.61,51.87
SWDIO  (via drill 0.3)
  Top 0.254: U3.PA13 36.15,37.14 v37.26,37.14 | D1.4 46.87,54.64 SV1.5
  Bottom 0.254: v37.26,37.14 38.48,38.36 38.48,51.24 39.37,52.12 45.47,52.12 46.1,52.76 46.1,54.16 47.38,55.44 SV1.5
USART3_RX  (via drill 0.3)
  Top 0.254: v39.8,50.8 39.13,50.11 U3.PB11 | D1.6 43.37,56 43.69,56.32 46.35,56.32 46.74,56.7 48.69,56.7 SV1.6
  Bottom 0.254: SV1.6 48.9,54.39 48.9,51.87 48.64,51.62 47.95,50.93 47.83,50.8 v39.8,50.8
USART3_TX  (via drill 0.3)
  Top 0.254: U3.PB10 39.62,49.56 v39.85,49.79 | D1.1 43.37,53.21 43.81,53.65 46.35,53.65 46.86,54.16 48.69,54.16 SV1.8
  Bottom 0.254: SV1.8 50.16,53.12 50.16,51.49 48.77,50.09 40.16,50.09 v39.85,49.79
VCAP_1
  Top 0.305: U3.VCAP_1 38.63,46.54 37.9,47.27 VCAP_1.1
VCAP_2
  Top 0.305: U3.VCAP_2 34.28,36.65 VCAP_2.1
VCC  (via drill 0.3, 0.6)
  Top 0.254: v45.52,19.43 45.12,19.43 45.09,19.4
  Top 0.406: v38.91,27.31 38.9,27.96 R1_1.2
  Top 0.61: v47.62,15.93 44.45,19.1 C2_1.1
  Top 1.27: C2_1.1 44.47,19.4 45.09,19.4 L1_1.2
  Bottom 0.406: v45.52,19.43 43.31,19.43 41.27,21.47 38.94,21.47 38.25,22.15 38.25,25.94 38.91,26.6 v38.91,27.31 | 86.11,40.19 86.23,40.19
  Bottom 0.61: 93.47,40.19 93.47,50.98 89.66,54.79 89.66,58.35 74.3,73.71 71.63,73.71 67.06,78.29 57.4,78.29 56.08,76.96 M2.+ | 93.47,40.19 93.47,29.52 91.44,27.49 91.44,26.22 90.04,24.82 90.04,22.53 73.28,5.77 69.98,5.77 66.55,2.34 61.85,2.34 58.95,5.24 55.65,5.24 55.24,5.64 | 55.24,5.64 54.86,6.02 54.86,9.2 48.13,15.93 v47.62,15.93 | 87.5,40.19 87,40.69 M6.+ | M4.+ 85.57,32.86 85.57,39.53 86.23,40.19 87.5,40.19 | M7.+ 56.08,6.48 55.24,5.64 | 80.01,52.25 M3.+ 80.39,50.22 85.75,44.86 85.75,40.54 86.11,40.19 | 87.5,40.19 89.79,40.19 | 89.79,40.19 93.47,40.19 | M5.+ 89.79,39.23 89.79,40.19

### Text on the board
bStop: PL | 2017 | K.Trzcinski | K.Dworakowaski | Dixi